# Altium schematic sheet ATMEGA328P.SchDoc
size A4; SheetNumber: 2; SheetTotal: 7; SPICEModelCacheTSLKCINH: <root> / <DocumentId>TSLKCINH</DocumentId> / <CacheFrame Number="0"> / <Model Name="cap" Kind="MDL"> / <Text>*Default semiconductor capacitor / .MODEL CAP C()</Text> / </Model> / </CacheFrame> / </root>
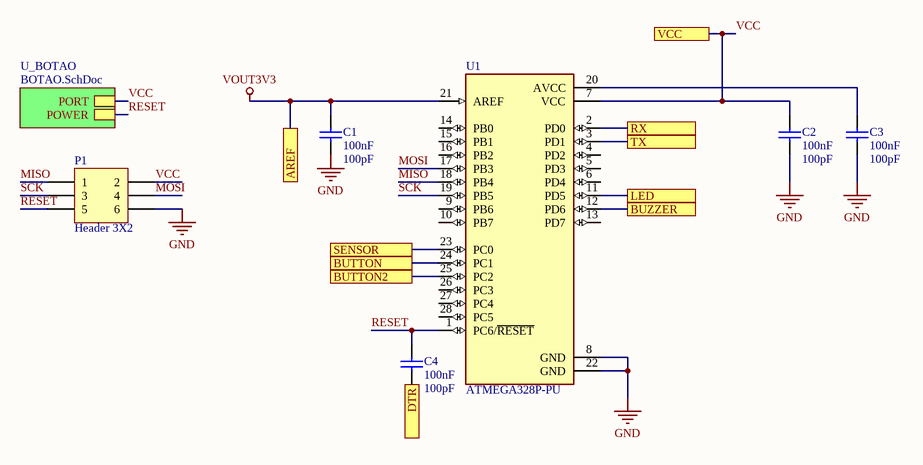
[diagram p0: ATMEGA328P.SchDoc]

## Parts
C1  100nF  value 100pF  [RAD-0.3]
C2  100nF  value 100pF  [RAD-0.3]
C3  100nF  value 100pF  [RAD-0.3]
C4  100nF  value 100pF  [RAD-0.3]
P1  Header 3X2  [HDR2X3]
U1  ATMEGA328P-PU  [DIP794W46P254L2967H457Q28B]

## Sub-sheets
U_BOTAO = BOTAO.SchDoc: POWER, PORT

## Ports
AREF, BUTTON, BUTTON2, BUZZER, DTR, LED, RX, SENSOR, TX, VCC

## Nets
GND: C1.1 C2.1 C3.1 P1.6 U1.8(GND) U1.22(GND)
VOUT3V3: C1.2 U1.21(AREF) ; port AREF
BUTTON: U1.24(PC1) ; port BUTTON
BUTTON2: U1.25(PC2) ; port BUTTON2
BUZZER: U1.12(PD6) ; port BUZZER
DTR: C4.1 ; port DTR
LED: U1.11(PD5) ; port LED
MISO: P1.1 U1.18(PB4)
MOSI: P1.4 U1.17(PB3)
RESET: C4.2 P1.5 U1.1(PC6/~{RESET}) ; sheet U_BOTAO/POWER
RX: U1.2(PD0) ; port RX
SCK: P1.3 U1.19(PB5)
SENSOR: U1.23(PC0) ; port SENSOR
TX: U1.3(PD1) ; port TX
VCC: C2.2 P1.2 U1.7(VCC) ; port VCC, sheet U_BOTAO/PORT
NetC3_2: C3.2 U1.20(AVCC)

Not connected (* = marked no-connect by the designer): U1 4(PD2) 5(PD3) 6(PD4) 9(PB6) 10(PB7) 13(PD7) 14(PB0) 15(PB1) 16(PB2) 26(PC3) 27(PC4) 28(PC5)

## Library data of the parts
C1-C4 = Cap: Capacitor; Published: 8-Jun-2000; LatestRevisionDate: 17-Jul-2002; LatestRevisionNote: Re-released for DXP Platform.; PackageReference: RAD-0.3; Publisher: Altium Limited; PackageDescription: Radial Cap, Thru-Hole; 2 Leads; 0.3 in Pin Spacing
P1 = Header 3X2: Header, 3-Pin, Dual row; LatestRevisionDate: 17-Jul-2002; LatestRevisionNote: Re-released for DXP Platform.; Publisher: Altium Limited
U1 = ATMEGA328P-PU: ATmega Series 20 MHz 32 KB Flash 2 KB SRAM 8-Bit Microcontroller - DIP-28; MP: ATMEGA328P-PU; Package: None; Availability: Unavailable; Price: None; Value: *